# EAGLE schematic MSP430-Reaction-Game-Modified (EAGLE 6.2)
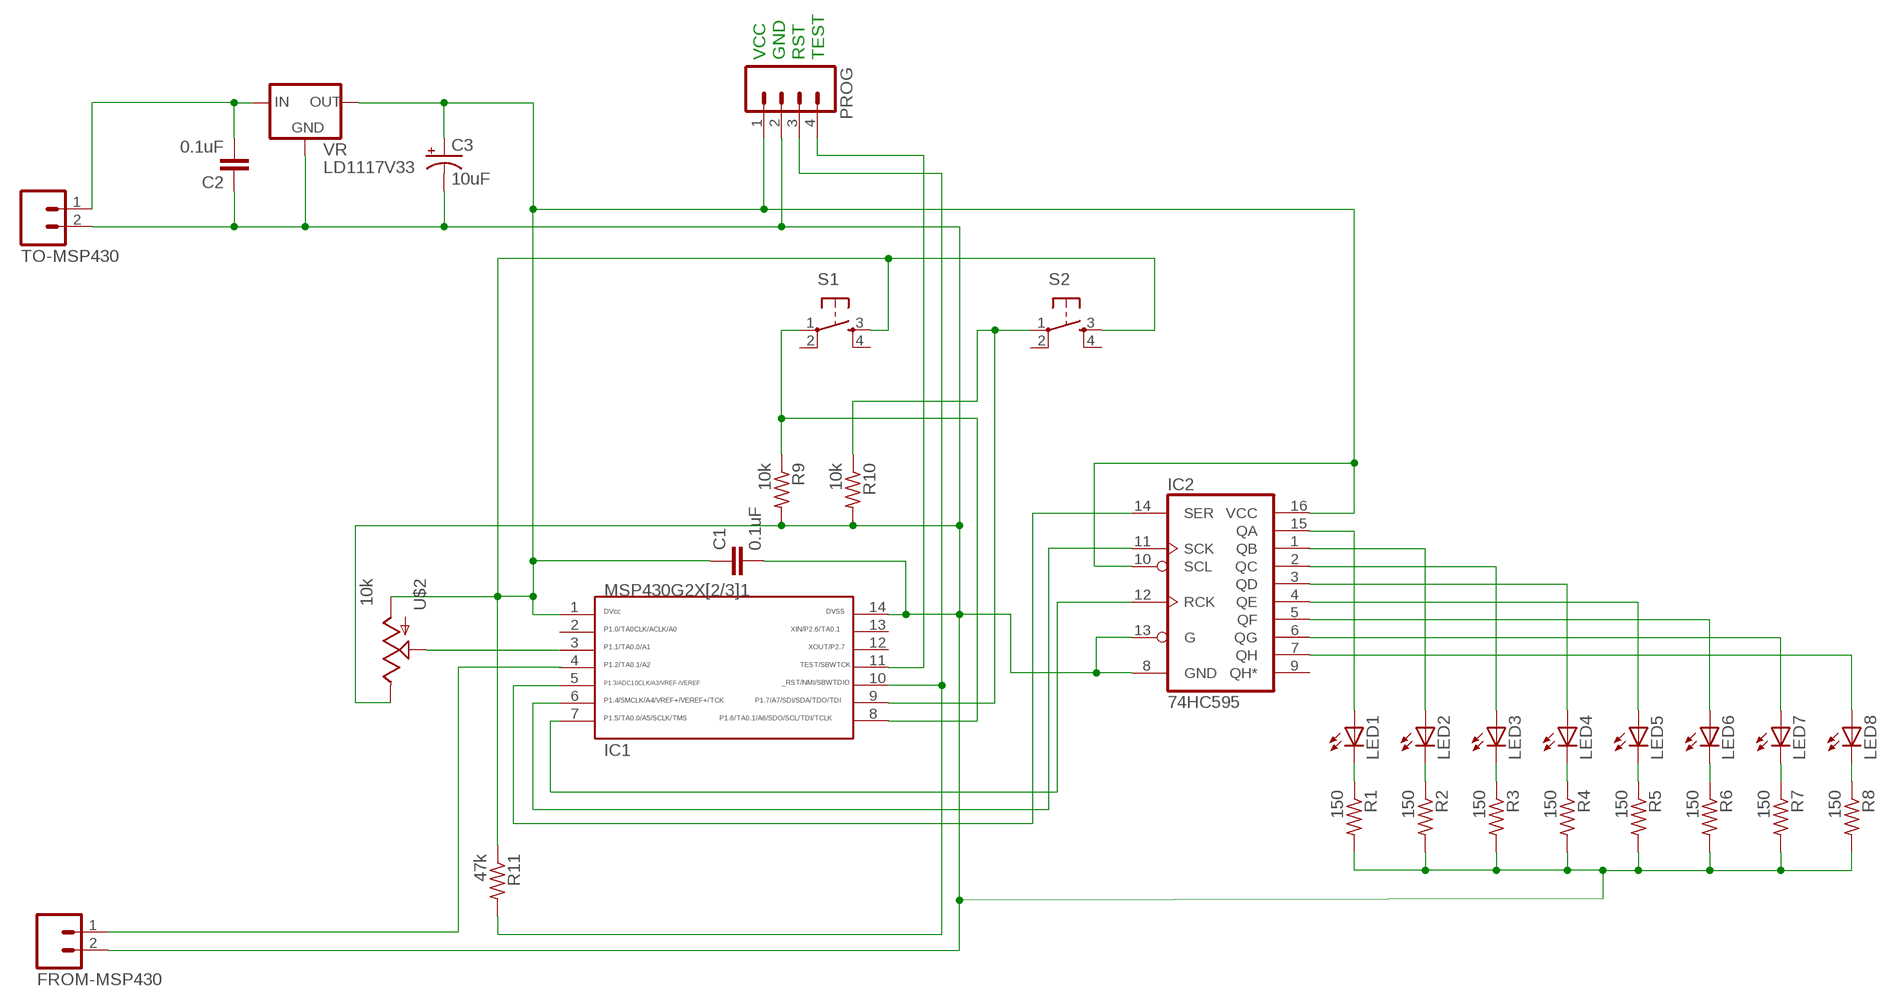
[diagram p0: schematic, sheet 1]

## Parts
C1  0.1uF  CAPPTH2  [CAP-PTH-SMALL2]
C2  0.1uF  CAPPTH2  [CAP-PTH-SMALL2]
C3  10uF  CAP_POLPTH1  [CPOL-RADIAL-100UF-25V]
FROM-MSP430  M02PTH3  [1X02_LONGPADS]
IC1  MSP430G2231  G2X[2/3]1---N14  [N14]
IC2  74HC595  74LS595N  [DIL16]
LED1  LED5MM  [LED5MM]
LED2  LED5MM  [LED5MM]
LED3  LED5MM  [LED5MM]
LED4  LED5MM  [LED5MM]
LED5  LED5MM  [LED5MM]
LED6  LED5MM  [LED5MM]
LED7  LED5MM  [LED5MM]
LED8  LED5MM  [LED5MM]
PROG  M04LOCK  [1X04_LOCK]
R1  150  R-US_0207/10  [0207/10]
R2  150  R-US_0207/10  [0207/10]
R3  150  R-US_0207/10  [0207/10]
R4  150  R-US_0207/10  [0207/10]
R5  150  R-US_0207/10  [0207/10]
R6  150  R-US_0207/10  [0207/10]
R7  150  R-US_0207/10  [0207/10]
R8  150  R-US_0207/10  [0207/10]
R9  10k  R-US_0207/10  [0207/10]
R10  10k  R-US_0207/10  [0207/10]
R11  47k  R-US_0207/10  [0207/10]
S1  TAC_SWITCHPTH  [TACTILE-PTH]
S2  TAC_SWITCHPTH  [TACTILE-PTH]
TO-MSP430  M02PTH3  [1X02_LONGPADS]
U$2  10k  POT  [ALPS_POT]
VR  LD1117V33  V_REG_LD1117VXX  [78XXL]

## Nets
N$1: LED1.K(C) R1.1
N$2: LED2.K(C) R2.1
N$3: LED3.K(C) R3.1
N$4: LED4.K(C) R4.1
N$5: LED5.K(C) R5.1
N$6: LED6.K(C) R6.1
N$7: LED7.K(C) R7.1
N$8: LED8.K(C) R8.1
N$9: IC2.15(QA) LED1.A
N$10: IC2.1(QB) LED2.A
N$11: IC2.2(QC) LED3.A
N$12: IC2.3(QD) LED4.A
N$13: IC2.4(QE) LED5.A
N$14: IC2.5(QF) LED6.A
N$15: IC2.6(QG) LED7.A
N$16: IC2.7(QH) LED8.A
N$17: IC1.3 U$2.P$2(S)
N$18: IC1.10 PROG.3 R11.2
N$19: FROM-MSP430.1
N$20: IC1.5 IC2.14(SER)
N$21: IC1.7 IC2.12(RCK)
N$22: IC1.6 IC2.11(SCK)
N$23: IC1.8 R9.1 S1.1
N$25: IC1.9 R10.1 S2.1
N$26: C1.2 C2.1 C3.2(-) FROM-MSP430.2 IC1.14 IC2.8(GND) IC2.13(G) PROG.2 R1.2 R2.2 R3.2 R4.2 R5.2 R6.2 R7.2 R8.2 R9.2 R10.2 TO-MSP430.2 U$2.P$1(E) VR.IN(GND)
N$27: IC1.11 PROG.4
N$29: C2.2 TO-MSP430.1 VR.OUT(IN)
N$30: C1.1 C3.1(+) IC1.1 IC2.10(SCL) IC2.16(VCC) PROG.1 R11.1 S1.3 S2.3 U$2.P$3(A) VR.GND(OUT)
Unconnected: IC1.2 IC1.4 IC1.12 IC1.13 IC2.9(QH*) S1.2 S1.4 S2.2 S2.4

## Notes on the sheet
- VCC | GND | RST | TEST

## Library data of the parts
C1 C2 = SparkFun:CAP: Capacitor Standard 0603 ceramic capacitor, and 0.1" leaded capacitor.
C3 = SparkFun:CAP_POL: Capacitor Polarized These are standard SMD and PTH capacitors. Normally 10uF, 47uF, and 100uF in electrolytic and tantalum varieties. Always verify the external diameter of the through hole cap, it varies with capacity, voltage, and manufacturer. The EIA devices should be standard.
FROM-MSP430 TO-MSP430 = SparkFun:M02: Header 2 Standard 2-pin 0.1" header. Use with straight break away headers (SKU : PRT-00116), right angle break away headers (PRT-00553), swiss pins (PRT-00743), machine pins (PRT-00117), and female headers (PRT-00115). Molex polarized connector foot print use with SKU : PRT-08233 with associated crimp pins and housings.
IC1 = TI_MSP430_v16:G2X[2/3]1---N14: MSP430G2X[2/3]1 PDIP (N) 14 Pin Package http://focus.ti.com/docs/prod/folders/print/msp430g2221.html MSP430G2121, MSP430G2221, MSP430G2131
IC2 = SparkFun:74*595: 8-bit SHIFT REGISTER, output latch
LED1-LED8 = SparkFun:LED: LEDs Standard schematic elements and footprints for 5mm, 3mm, 1206, and 0603 sized LEDs. 5mm - Spark Fun Electronics SKU : COM-00529 (and others)
PROG = SparkFun:M04: Header 4 Standard 4-pin 0.1" header. Use with straight break away headers (SKU : PRT-00116), right angle break away headers (PRT-00553), swiss pins (PRT-00743), machine pins (PRT-00117), and female headers (PRT-00115). Molex polarized connector foot print use with SKU : PRT-08231 with associated crimp pins and housings. 1MM SMD Version SKU: PRT-10208
R1-R11 = resistor:R-US_: RESISTOR, American symbol
S1 S2 = SparkFun:TAC_SWITCH: Momentary Switch Button commonly used for reset or general input. Spark Fun Electronics SKU : COM-00097
U$2 = SparkFun:POT
VR = SparkFun:V_REG_LD1117VXX: LD1117VXX voltage regulator. We carry the 3.3V version (COM-00526) in TO-220 package.